# EAGLE design badge (EAGLE 8.2.2)

## Sheet 1 of 2
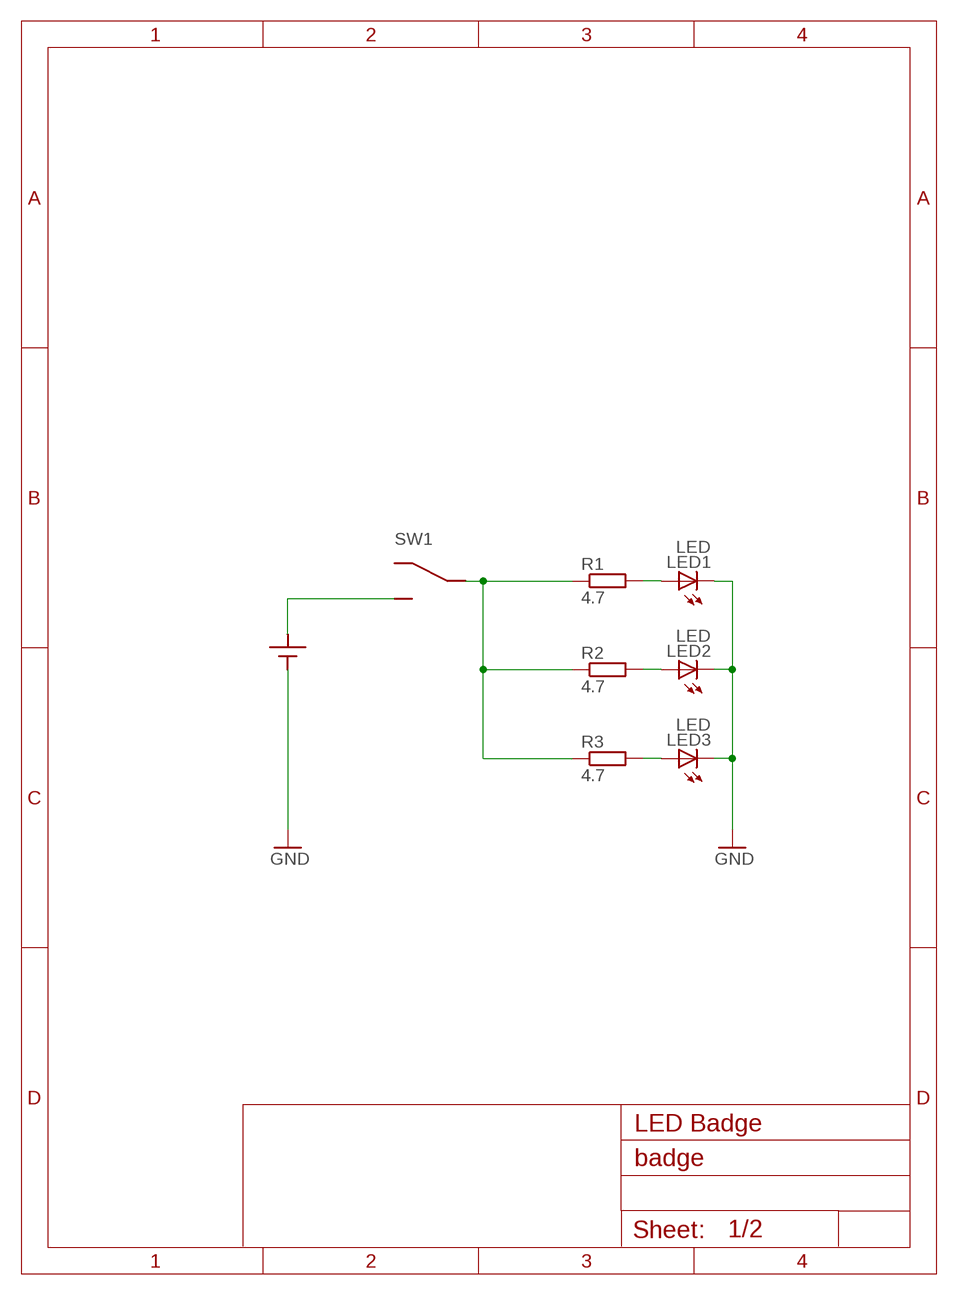
[diagram p0: schematic, sheet 1]

### Parts
LED1  LED  [LED5MM]
LED2  LED  [LED5MM]
LED3  LED  [LED5MM]
R1  4.7  RESISTOR_207  [0207/10]
R2  4.7  RESISTOR_207  [0207/10]
R3  4.7  RESISTOR_207  [0207/10]
SW1  SWITCH  [SWITCH]
X1  BATTERYHOLDER_SMD  [BATTERYHOLDER_SMD]

### Nets
GND: LED1.K(C) LED2.K(C) LED3.K(C) X1.-
N$1: LED1.A R1.2
N$2: R1.1 R2.1 R3.1 SW1.C
N$3: LED2.A R2.2
N$4: LED3.A R3.2
N$5: SW1.NO X1.+
Unconnected: SW1.NC

### Notes on the sheet
- LED Badge

## Sheet 2 of 2
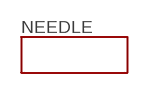
[diagram p1: schematic, sheet 2]

### Parts
NEEDLE  NEEDLE  [NEEDLE_PAD]

## Library data of the parts
LED1-LED3 = badge:LED
NEEDLE = badge:NEEDLE
R1-R3 = badge:RESISTOR_207
SW1 = badge:SWITCH
X1 = badge:BATTERYHOLDER_SMD

## Board
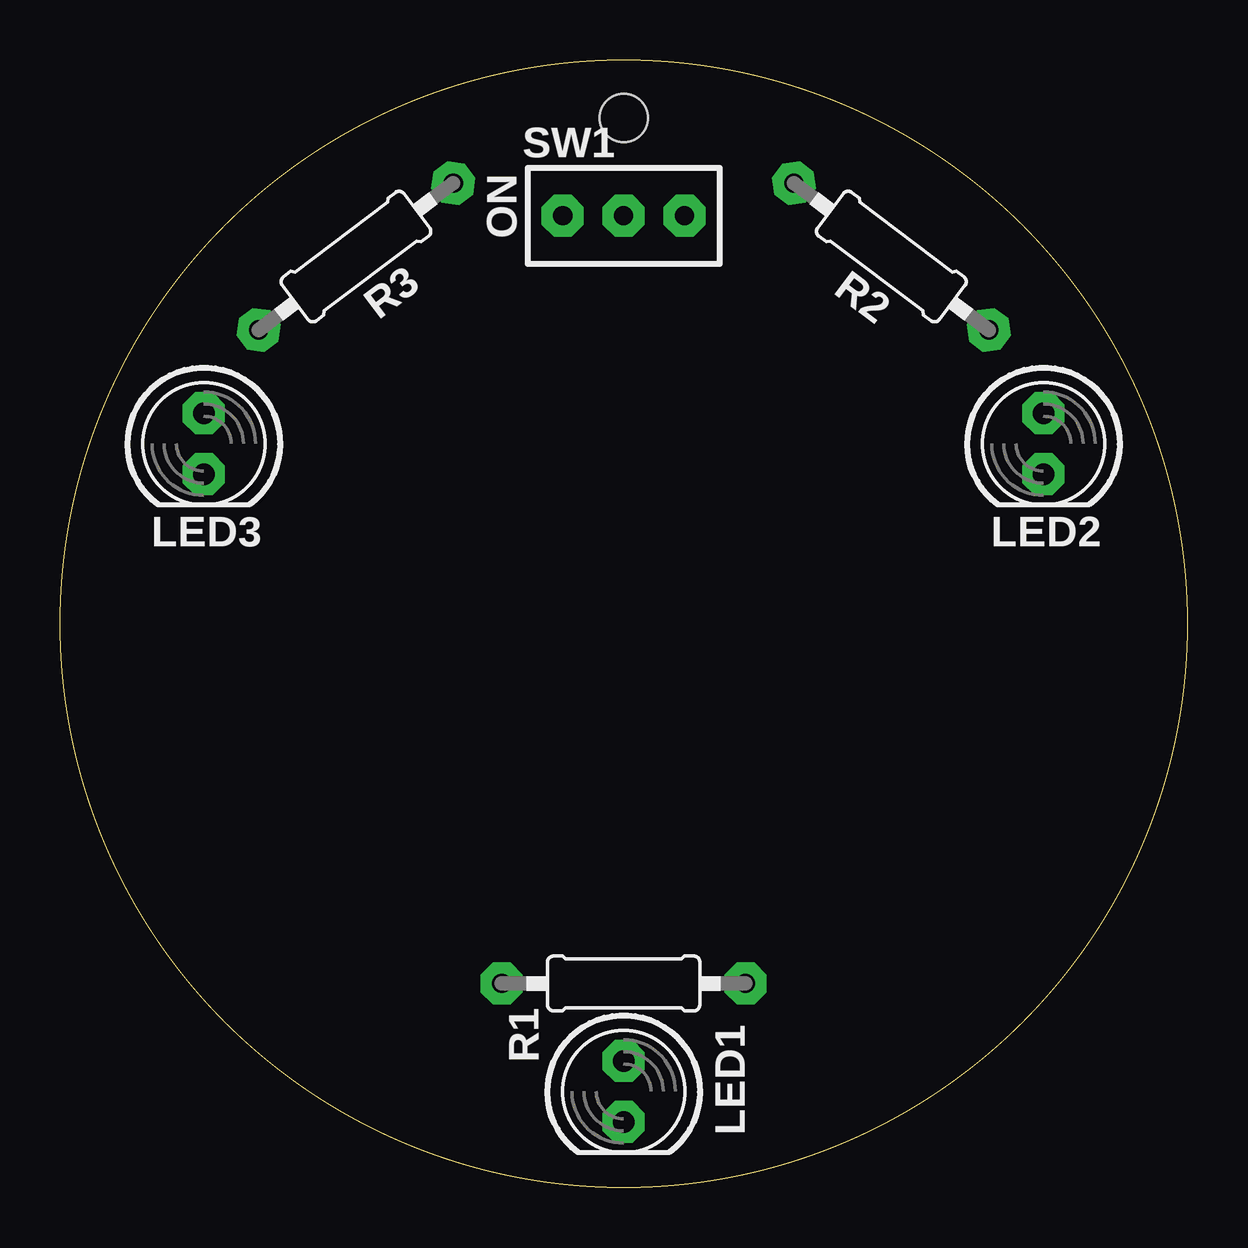
[diagram p2: board, top side]
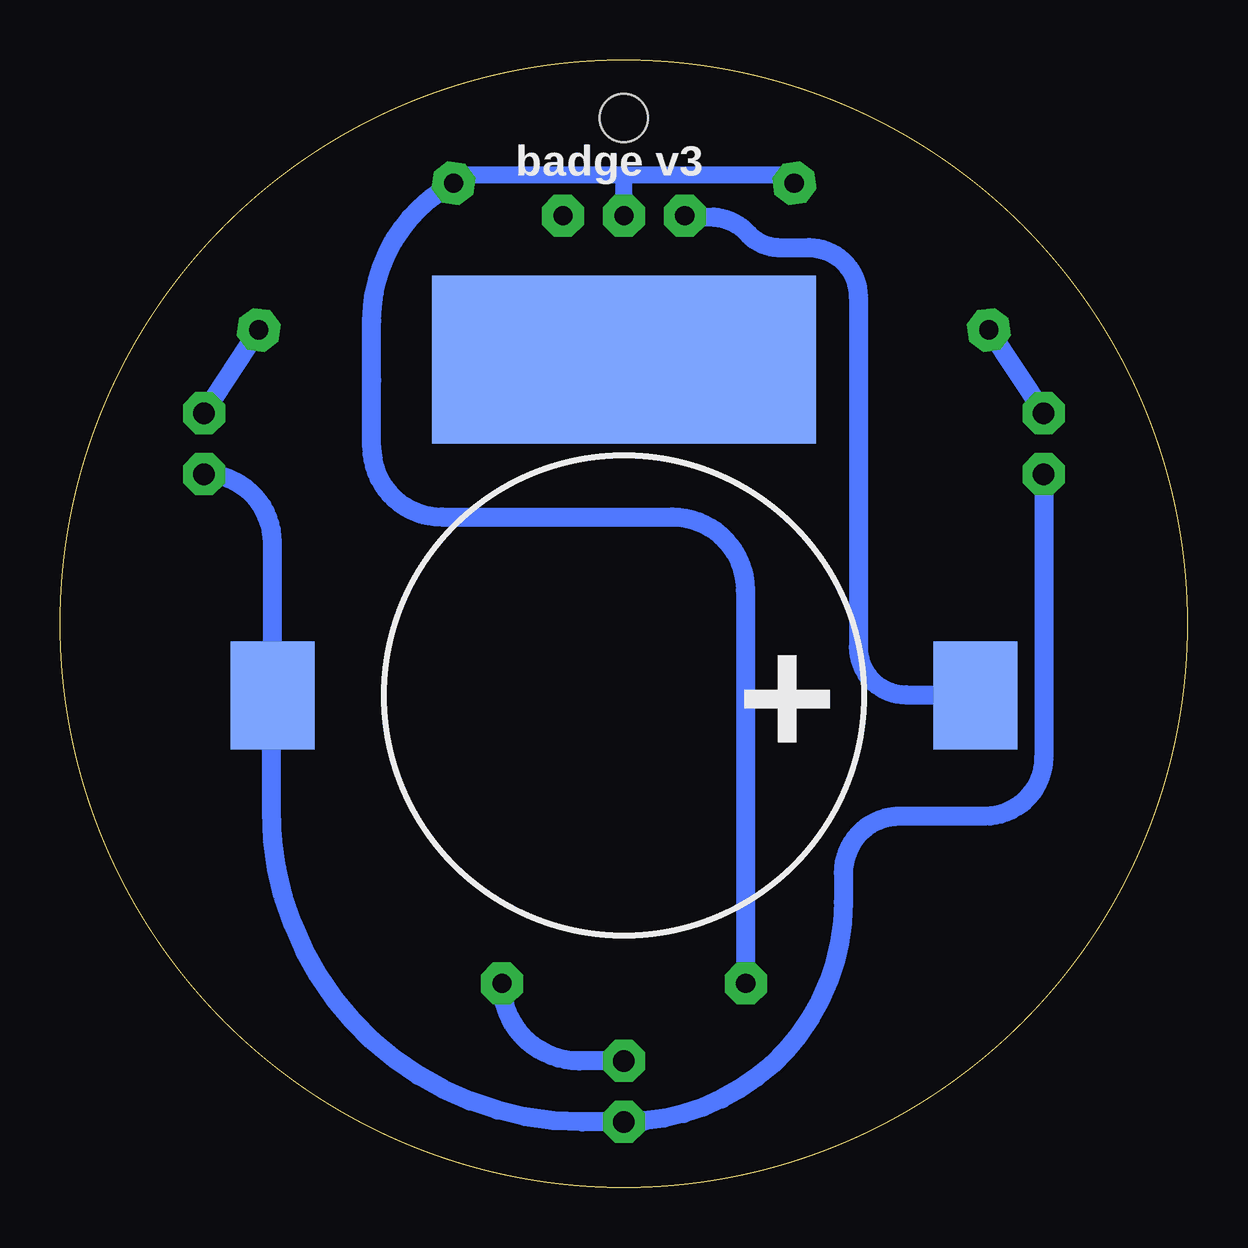
[diagram p3: board, bottom side, seen from below]

Size 47 x 47 mm. Coordinates in mm from the lower left corner, seen from the top.
Outline: circle at 23.5,23.5 radius 23.5
Copper layers (1*16): Top 0.035mm / dielectric 1.5mm / Bottom 0.035mm
Design rules "default": minimum track width 6mil, minimum drill 0.35mm, track to track 6mil, track to pad 6mil, pad to pad 6mil, via to via 6mil, smd to smd 6mil, copper to edge 40mil, drill to drill 6mil, minimum pad ring 10mil, minimum via ring 8mil, stop-mask expansion 4mil, vias tented up to drill 0mil, thermal gap 10mil
Holes 2 mm at 23.5,44.58

### Footprints (pad centres in the part's own frame; a part is rotated, then mirrored left to right if it is on the bottom)
LED5MM = drill 0.9 pad 1.75 octagon: A -1.27,0; K 1.27,0
NEEDLE_PAD = smd 16 x 7: P$1 0,0
0207/10 = drill 0.8 pad 1.75 octagon: 1 -5.08,0; 2 5.08,0
SWITCH = drill 0.8 pad 1.75 octagon: C 0,0; NC 2.54,0; NO -2.54,0
BATTERYHOLDER_SMD = smd 3.5 x 4.5: + -14.65,0; - 14.65,0

### Placement (x,y rotation side)
LED1  23.5,4.01 270 top
LED2  41,31.01 270 top
LED3  6,31.01 270 top
NEEDLE  23.5,34.51 0 bottom
R1  23.5,8.51 0 top
R2  34.66,38.81 323 top
R3  12.34,38.81 217 top
SW1  23.5,40.51 0 top
X1  23.5,20.51 180 bottom

### Tracks (layer width: path | path; a pad name or v marks a point on that pad's centre or on a via)
GND
  Bottom 0.8: LED3.K 6,17.94 arc90 8.46,15.48 11.99,15.48 arc-90 14.35,13.12 14.35,11.89 arc90 LED1.K 25.23,2.74 arc90 38.18,15.69 38.18,20.47 arc90 X1.- 38.15,26.89 arc-90 LED2.K
N$1
  Bottom 0.8: LED1.A 25.35,5.28 arc90 R1.2
N$2
  Bottom 0.7: 16.73,42.2 23.45,42.2 | 23.45,42.2 30.26,42.2 | SW1.C 23.5,42.15 23.45,42.2
  Bottom 0.8: R3.1 arc-90 16.73,42.2 | 30.26,42.2 arc-90 R2.1 arc-61 34,36.13 34,33.65 34,30.86 arc-90 31.09,27.95 21.48,27.95 arc90 18.43,24.9 18.43,8.52 arc-90 R1.1
N$3
  Bottom 0.8: LED2.A R2.2
N$4
  Bottom 0.8: R3.2 LED3.A
N$5
  Bottom 0.8: SW1.NO 19.75,40.45 arc45 18.34,39.78 arc-45 17.09,39.18 15.78,39.18 arc90 13.72,37.12 13.72,22.52 arc-90 11.73,20.54 8.22,20.54 arc90 8.02,20.33 8.67,20.33 arc90 X1.+

### Text on the board
bPlace: badge v3